# Altium project Sonar.PrjPcb
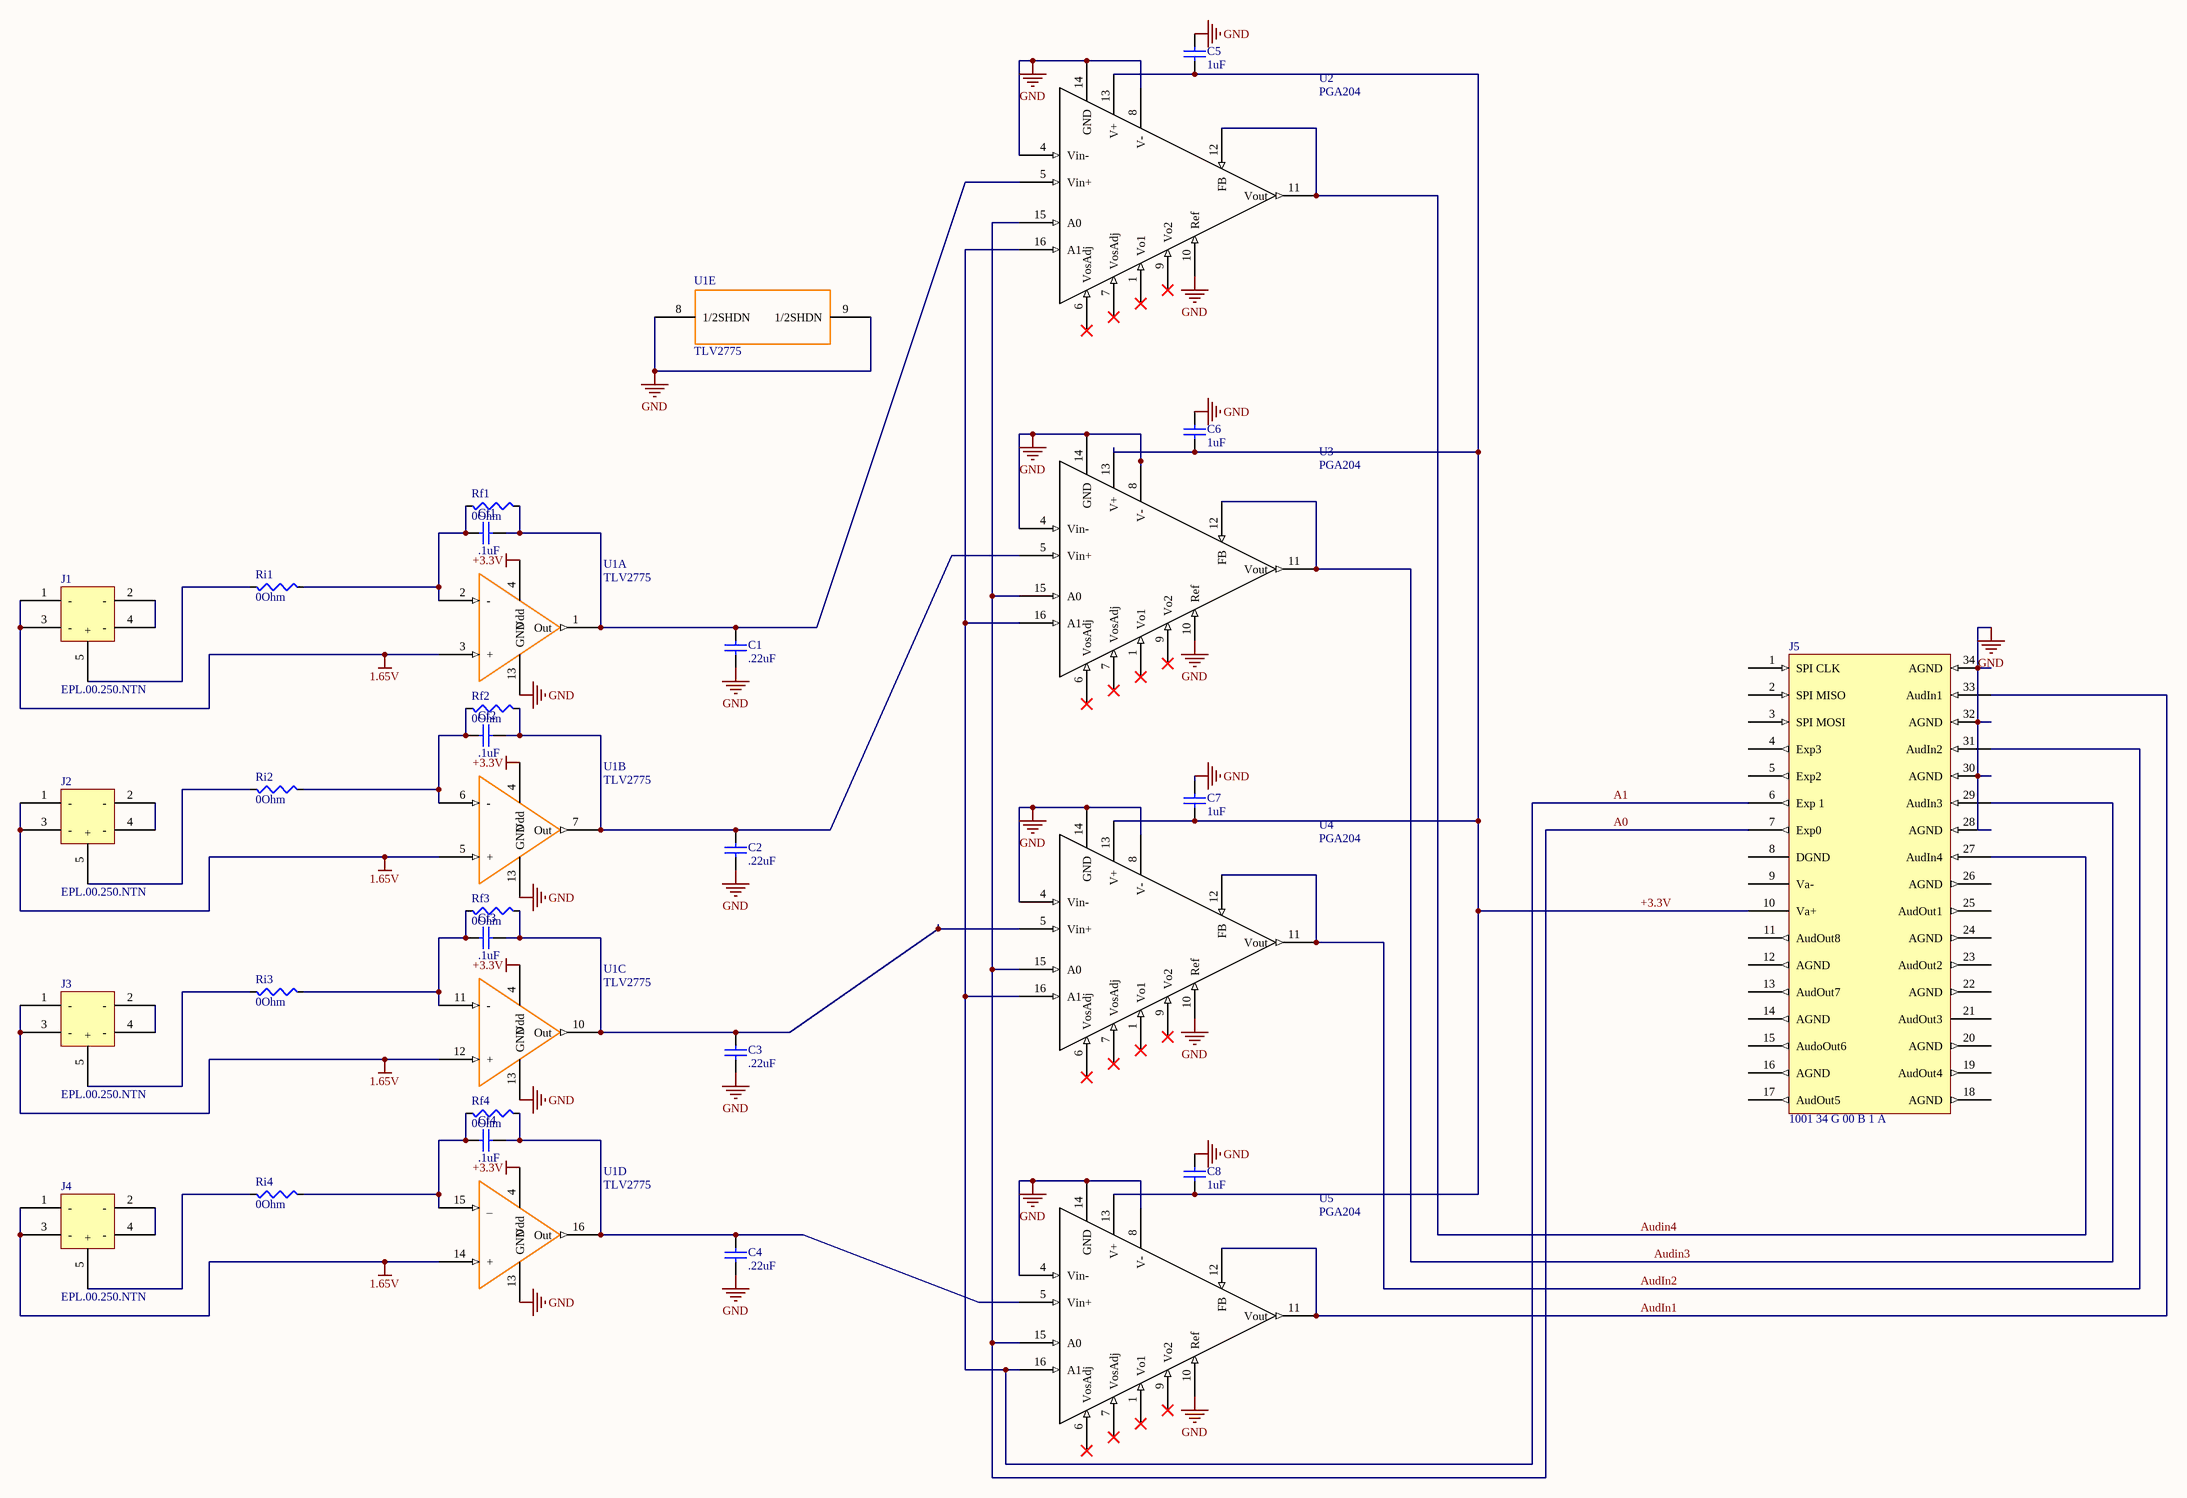
[diagram p0: Sonar.SchDoc]
1 sheet, 30 parts. Net scope: global (net labels, ports and power ports of the same name join across sheets).
Board file: Sonar.PcbDoc

## Sheet Sonar.SchDoc: Sonar Pre-Processor
size OrCAD E; Author: Turner Topping; CompanyName: YoYoDyne

### Parts
C1  .22uF  [0805 (2012) Capacitor]
C2  .22uF  [0805 (2012) Capacitor]
C3  .22uF  [0805 (2012) Capacitor]
C4  .22uF  [0805 (2012) Capacitor]
C5  1uF  [0805 (2012) Capacitor]
C6  1uF  [0805 (2012) Capacitor]
C7  1uF  [0805 (2012) Capacitor]
C8  1uF  [0805 (2012) Capacitor]
Cf1  .1uF  [0805 (2012) Capacitor]
Cf2  .1uF  [0805 (2012) Capacitor]
Cf3  .1uF  [0805 (2012) Capacitor]
Cf4  .1uF  [0805 (2012) Capacitor]
J1  EPL.00.250.NTN  [EPL.00.250.NTN_1]
J2  EPL.00.250.NTN  [EPL.00.250.NTN_1]
J3  EPL.00.250.NTN  [EPL.00.250.NTN_1]
J4  EPL.00.250.NTN  [EPL.00.250.NTN_1]
J5  1001 34 G 00 B 1 A  [1001]
Rf1  0Ohm  [R 0805 (2012) RESISTOR]
Rf2  0Ohm  [R 0805 (2012) RESISTOR]
Rf3  0Ohm  [R 0805 (2012) RESISTOR]
Rf4  0Ohm  [R 0805 (2012) RESISTOR]
Ri1  0Ohm  [R 0805 (2012) RESISTOR]
Ri2  0Ohm  [R 0805 (2012) RESISTOR]
Ri3  0Ohm  [R 0805 (2012) RESISTOR]
Ri4  0Ohm  [R 0805 (2012) RESISTOR]
U1  TLV2775  [TlV2775AIPW]  (parts A,B,C,D,E of 5)
U2  PGA204  [SOIC 16]
U3  PGA204  [SOIC 16]
U4  PGA204  [SOIC 16]
U5  PGA204  [SOIC 16]

### Nets
1.65V: J1.1(-) J1.3(-) J2.1(-) J2.3(-) J3.1(-) J3.3(-) J4.1(-) J4.3(-) U1.3(+) U1.5(+) U1.12(+) U1.14(+)
+3.3V: C5.1 C6.1 C7.1 C8.1 J5.10(Va+) U1.4(Vdd) U2.13(V+) U3.13(V+) U4.13(V+) U5.13(V+)
GND: C1.1 C2.1 C3.1 C4.1 C5.2 C6.2 C7.2 C8.2 J5.28(AGND) J5.30(AGND) J5.32(AGND) J5.34(AGND) U1.8(1/2SHDN) U1.9(1/2SHDN) U1.13(GND) U2.4(Vin-) U2.8(V-) U2.10(Ref) U2.14(GND) U3.4(Vin-) U3.8(V-) U3.14(GND) U4.4(Vin-) U4.8(V-) U4.14(GND) U5.4(Vin-) U5.8(V-) U5.10(Ref) U5.14(GND)
A0: J5.7(Exp0) U2.15(A0) U3.15(A0) U4.15(A0) U5.15(A0)
A1: J5.6(Exp_1) U2.16(A1) U3.16(A1) U4.16(A1) U5.16(A1)
AudIn1: J5.33(AudIn1) U5.11(Vout) U5.12(FB)
AudIn2: J5.31(AudIn2) U4.11(Vout) U4.12(FB)
Audin3: J5.29(AudIn3) U3.11(Vout) U3.12(FB)
Audin4: J5.27(AudIn4) U2.11(Vout) U2.12(FB)
NetC1_2: C1.2 Cf1.2 Rf1.2 U1.1(Out) U2.5(Vin+)
NetC2_2: C2.2 Cf2.2 Rf2.2 U1.7(Out) U3.5(Vin+)
NetC3_2: C3.2 Cf3.2 Rf3.2 U1.10(Out) U4.5(Vin+)
NetC4_2: C4.2 Cf4.2 Rf4.2 U1.16(Out) U5.5(Vin+)
NetCf1_1: Cf1.1 Rf1.1 Ri1.2 U1.2(-)
NetCf2_1: Cf2.1 Rf2.1 Ri2.2 U1.6(-)
NetCf3_1: Cf3.1 Rf3.1 Ri3.2 U1.11(-)
NetCf4_1: Cf4.1 Rf4.1 Ri4.2 U1.15(_)
NetJ1_2: J1.2(-) J1.4(-)
NetJ1_5: J1.5(+) Ri1.1
NetJ2_2: J2.2(-) J2.4(-)
NetJ2_5: J2.5(+) Ri2.1
NetJ3_2: J3.2(-) J3.4(-)
NetJ3_5: J3.5(+) Ri3.1
NetJ4_2: J4.2(-) J4.4(-)
NetJ4_5: J4.5(+) Ri4.1

Not connected (* = marked no-connect by the designer): J5 1(SPI_CLK) 2(SPI_MISO) 3(SPI_MOSI) 4(Exp3) 5(Exp2) 8(DGND) 9(Va-) 11(AudOut8) 12(AGND) 13(AudOut7) 14(AGND) 15(AudoOut6) 16(AGND) 17(AudOut5) 18(AGND) 19(AudOut4) 20(AGND) 21(AudOut3) 22(AGND) 23(AudOut2) 24(AGND) 25(AudOut1) 26(AGND); U2 1(Vo1)* 6(VosAdj)* 7(VosAdj)* 9(Vo2)*; U3 1(Vo1)* 6(VosAdj)* 7(VosAdj)* 9(Vo2)* 10(Ref); U4 1(Vo1)* 6(VosAdj)* 7(VosAdj)* 9(Vo2)* 10(Ref); U5 1(Vo1)* 6(VosAdj)* 7(VosAdj)* 9(Vo2)*

### Notes on the sheet
- Labels drawn without touching a wire or pin: GND
- Title
- Size:
- Date:
- File:
- Orcad E
- Number:
- Time:
- Revision:
- Sheet
- of

### Library data of the parts
C1-C8 = Capacitor (non-polarized): Capacitor; Value: .1uF
Cf1-Cf4 = Capacitor (non-polarized): Capacitor; Value: .1uF
Rf1-Rf4 Ri1-Ri4 = Resistor: Value: 0Ohm
U1 = TLV2775: 2.7 V High-Slew-Rate Rail-to-Rail Output Operation Amplifer with ShutDown